# EAGLE schematic hbridge (EAGLE 9.2.2)
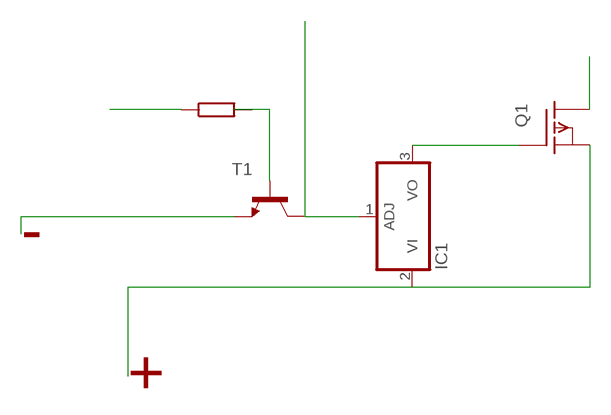
[diagram p0: schematic, sheet 1]

## Parts
IC1  337T  [TO220H]
Q1  IRF9530  [TO220]
T1  2N2222  [TO18]

## Nets
N$1: IC1.2(VI) Q1.3(S)
N$2: T1.2(B)
N$3: IC1.3(VO) Q1.1(G)
N$4: Q1.2(D)
T1_C: IC1.1(ADJ) T1.3(C)
T1_E: T1.1(E)

## Notes on the sheet
- -
- +

## Library data of the parts
IC1 = linear:*337: Negative VOLTAGE REGULATOR
Q1 = transistor-fet:IRF9530: P-Channel Enhancement MOSFET (HEXFET); -100V; -12A; 0,3Ohm
T1 = transistor:2N2222: NPN TRANSISTOR